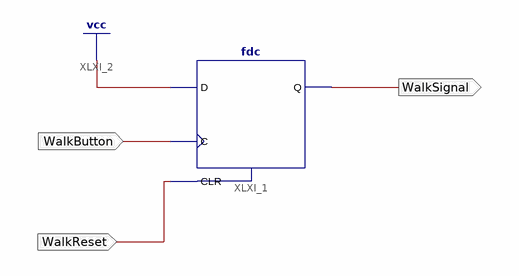
[diagram p0: schematic sheet 1]
// Xilinx ISE schematic WalkRegister.sch (spartan6) as structural Verilog: 1 symbols, 3 ports
module WalkRegister (
  input  WalkReset,
  input  WalkButton,
  output WalkSignal
);

  fdc XLXI_1 (.C(WalkButton), .CLR(WalkReset), .D(1'b1), .Q(WalkSignal));
endmodule
